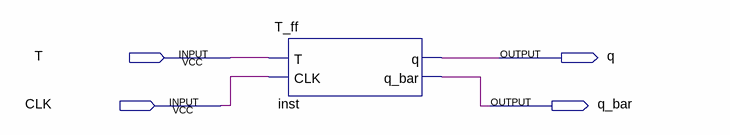
[diagram p0: schematic sheet]
// Quartus schematic Block1.bdf as structural Verilog: 1 symbols, 4 pins
module Block1 (
  input  T,
  input  CLK,
  output q,
  output q_bar
);

  T_ff inst (.T(T), .CLK(CLK), .q(q), .q_bar(q_bar));
endmodule
